# Altium project SIC462.PrjPcb
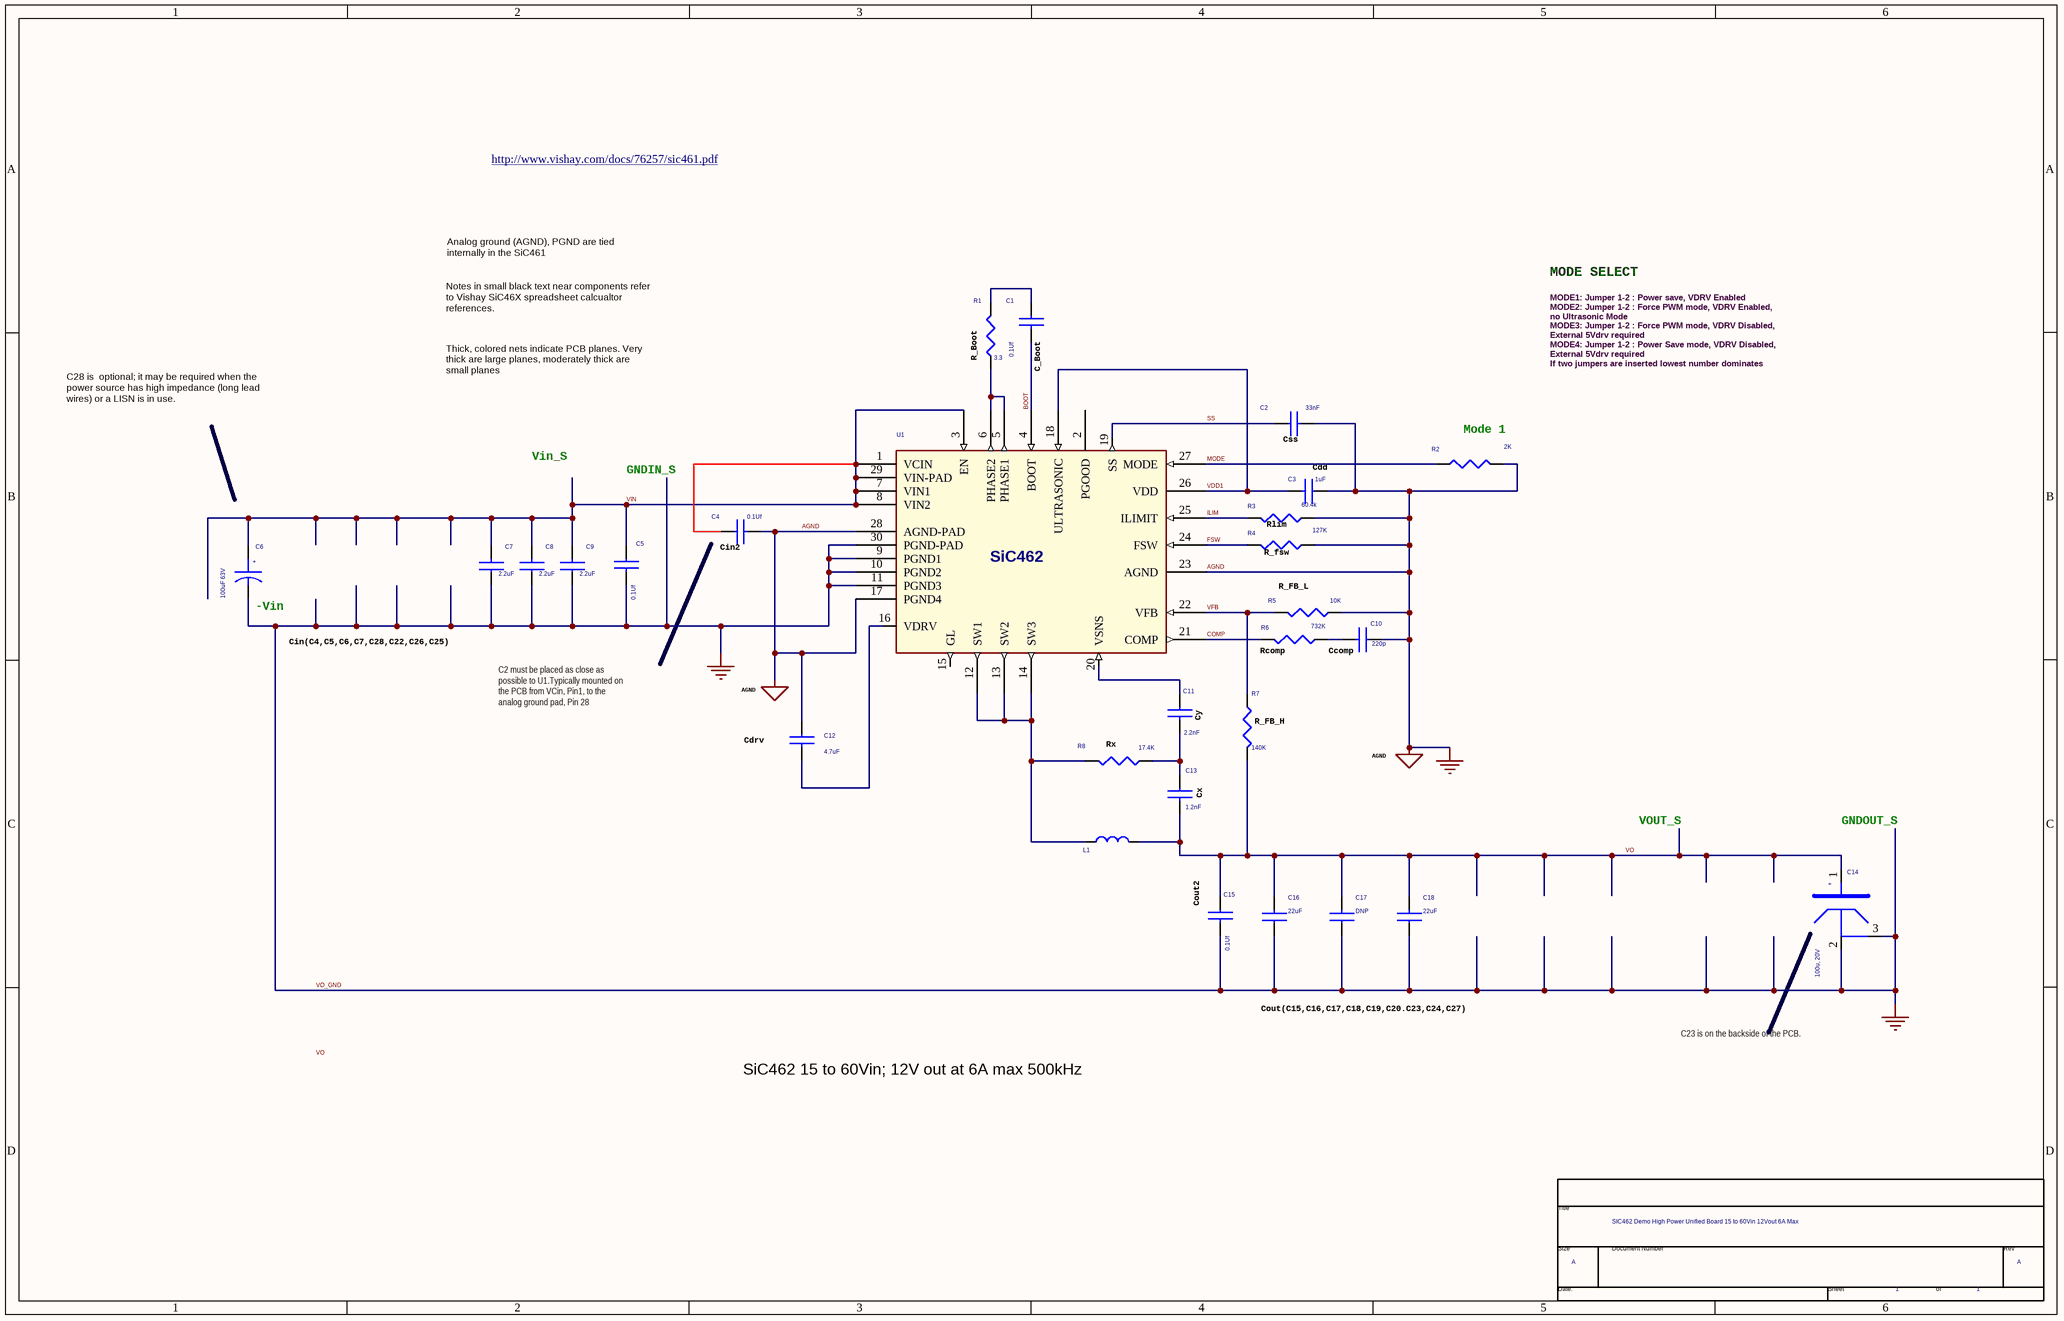
[diagram p0: SiC462 12V 6A.SchDoc]
1 sheet, 29 parts. Net scope: global (net labels, ports and power ports of the same name join across sheets).
Board file: PCB1.PcbDoc

## Sheet SiC462 12V 6A.SchDoc
size 386 x 246 mm

### Parts
*  RevCode: A  Title: SIC462 Demo High Power Unified Board 15 to 60Vin 12Vout 6A Max  Page Number: 1  (hidden comment: TitleBlock0)  (graphical)
C1  0.1Uf  [RR_0603]
C2  33nF  [RR_0603]
C3  1uF  [RR_0603]
C4  0.1Uf  [RR_0603]
C5  0.1Uf  [RR_0603]
C6  100uF 63V  [RR_CAP-RAD-D10x9]
C7  2.2uF  [RR_1210]
C8  2.2uF  [RR_1210]
C9  2.2uF  [RR_1210]
C10  220p  [RR_0603]
C11  2.2nF  [RR_0603]
C12  4.7uF  [RR_1206]
C13  1.2nF  [RR_0603]
C14  100u, 20V  [RR_CAP-RAD-D10x9]
C15  0.1Uf  [RR_0805]
C16  22uF  [RR_1206]
C17  DNP  [RR_1206]
C18  22uF  [RR_1206]
L1  (no value)  [RR_IND_CMD_12x12]
R1  3.3  [RR_0603]
R2  2K  [RR_0603]
R3  60.4k  [RR_0603]
R4  127K  [RR_0603]
R5  10K  [RR_0603]
R6  732K  [RR_0603]
R7  140K  [RR_0603]
R8  17.4K  [RR_0603]
U1  SiC462  [SIC462]

### Nets
AGND: C2.2 C3.1 C4.2 C5.2 C6.2 C7.1 C8.1 C9.1 C10.1 C12.1 C14.2 C14.3 C15.2 C16.1 C17.1 C18.1 R2.2 R3.1 R4.1 R5.1 U1.9(PGND1) U1.10(PGND2) U1.11(PGND3) U1.17(PGND4) U1.23(AGND) U1.28(AGND-PAD) U1.30(PGND-PAD)  [also labelled GND, GND_SIGNAL, VO_GND]
BOOT: C1.2 U1.4(BOOT)
COMP: R6.2 U1.21(COMP)
FSW: R4.2 U1.24(FSW)
ILIM: R3.2 U1.25(ILIMIT)
MODE: R2.1 U1.27(MODE)
SS: C2.1 U1.19(SS)
VDD1: C3.2 U1.18(ULTRASONIC) U1.26(VDD)
VFB: R5.2 R7.1 U1.22(VFB)
VIN: C4.1 C5.1 C6.1 C7.2 C8.2 C9.2 U1.1(VCIN) U1.3(EN) U1.7(VIN1) U1.8(VIN2) U1.29(VIN-PAD)
VO: C13.2 C14.1 C15.1 C16.2 C17.2 C18.2 L1.1(A) R7.2
NetC1_1: C1.1 R1.2
NetC10_2: C10.2 R6.1
NetC11_1: C11.1 U1.20(VSNS)
NetC11_2: C11.2 C13.1 R8.1
NetC12_2: C12.2 U1.16(VDRV)
NetL1_2: L1.2(B) R8.2 U1.12(SW1) U1.13(SW2) U1.14(SW3)
NetR1_1: R1.1 U1.5(PHASE1) U1.6(PHASE2)

Not connected (* = marked no-connect by the designer): U1 2(PGOOD) 15(GL)

### Notes on the sheet
- http://www.vishay.com/docs/76257/sic461.pdf
- Notes in small black text near components refer
  to Vishay SiC46X spreadsheet calcualtor
  references.
- Analog ground (AGND), PGND are tied
  internally in the SiC461
- MODE SELECT
- Thick, colored nets indicate PCB planes. Very
  thick are large planes, moderately thick are
  small planes
- (near R1) R_Boot
- (near C1) C_Boot
- C28 is  optional; it may be required when the
  power source has high impedance (long lead
  wires) or a LISN is in use.
- Vin_S
- (near C2) Css
- (near R2) Mode 1
- MODE1: Jumper 1-2 : Power save, VDRV Enabled
  MODE2: Jumper 1-2 : Force PWM mode, VDRV Enabled,
  no Ultrasonic Mode
  MODE3: Jumper 1-2 : Force PWM mode, VDRV Disabled,
  External 5Vdrv required
  MODE4: Jumper 1-2 : Power Save mode, VDRV Disabled,
  External 5Vdrv required
  If two jumpers are inserted lowest number dominates
- GNDIN_S
- (near R3) Rlim
- (near C3) Cdd
- (near C4) Cin2
- (near R4) R_fsw
- (near R5) R_FB_L
- (near C6) -Vin
- Cin(C4,C5,C6,C7,C28,C22,C26,C25)
- (near R6) Rcomp
- Ccomp
- C2 must be placed as close as
  possible to U1.Typically mounted on
  the PCB from VCin, Pin1, to the
  analog ground pad, Pin 28
- AGND
- (near C11) Cy
- (near R7) R_FB_H
- (near C12) Cdrv
- (near R8) Rx
- (near C13) Cx
- VOUT_S
- GNDOUT_S
- (near C15) Cout2
- Cout(C15,C16,C17,C18,C19,C20.C23,C24,C27)
- C23 is on the backside of the PCB.
- SiC462 15 to 60Vin; 12V out at 6A max 500kHz
- Labels drawn without touching a wire or pin: VO
- (in symbol CAP POL) +
- (in symbol CAP, TA-P,V,470u, 2V_0) +
- (in symbol TitleBlock0) Title; Size; Document Number; Rev; Date:; Sheet; of

### Library data of the parts
C1 C4 = CAP NP: Ceramic Cap, 0.1uF,100volts, X7S, 10%, 0603; Mfr: Murata Electronics; Mfr Part Number: C1608X7S2A104K080AB; Package2: 0603; Tolerance: 10%; DIGI-KEY: 810-C1608X7S2A104K; Package: 0603; Package1: 0603; PCB Footprint2: 0603; Description2: Ceramic Cap, 0.1uF,100volts, X7S, 10%, 0603; Value2: 0.1uF; Value1: 0.1uF; Description1: Ceramic Cap, 0.1uF,100volts, X7S, 10%, 0603; PCB Footprint1: 0603; Data sheet\: http://www.mouser.com/ds/2/400/lcc_commercial_general_en-837201.pdf; DigikeyMouser: 810-C1608X7S2A104K
C2 = CAP NP: Ceramic Cap, 0.033uF,50V,X7R,0603,10%; Mfr Part Number: VJ0603Y333KXACW1BC; Mfr: Vishay / Vitramon; Manufacturer: Vishay; Package1: 0603; Voltage: 50V; Tolerance: 10%; Data sheet\: http://www.mouser.com/ds/2/427/vjw1bcbascomseries-223529.pdf; DigikeyMouser: 77-VJ0603Y333KXACBC; Value2: 33nF; Value1: 33nF; Description1: Ceramic Cap, 0.033uF,50V,X7R,0603,10%; Description2: Ceramic Cap, 0.033uF,50V,X7R,0603,10%; Package: 0603; Package2: 0603; Manufacturer Part: VJ0603Y333KXACW1BC; Manufacturer Part1: VJ0603Y333KXACW1BC; Manufacturer Part2: VJ0603Y333KXACW1BC; Manufacturer1: Vishay; Manufacturer2: Vishay; DIGI-KEY: 77-VJ0603Y333KXACBC
C3 = CAP NP: Ceramic Cap, 1uF,50V, X7R,0603,10%; Manufacturer1: Taiyo Yuden; Manufacturer Part1: UMK107AB7105KA-T; Package2: 0603; Manufacturer2: Taiyo Yuden; Manufacturer Part2: UMK107AB7105KA-T; Manufacturer: Taiyo Yuden; Manufacturer Part: UMK107AB7105KA-T; Package: 0603; Package1: 0603; Description2: Ceramic Cap, 1uF,50V, X7R,0603,10%; Description1: Ceramic Cap, 1uF,50V, X7R,0603,10%; Value1: 1uF; Value2: 1uF; DigikeyMouser: 963-UMK107AB7105KA-T; Mfr: Taiyo Yuden; Data sheet\: http://www.mouser.com/ds/2/396/mlcc11_hq_e-541564.pdf; Tolerance: 10%; Voltage: 50V; Mfr Part Number: UMK107AB7105KA-T; DIGI-KEY: 963-UMK107AB7105KA-T
C5 C15 = CAP NP: Ceramic Cap, 0.1uF,100volts, X7S, 10%, 0603; Mfr Part Number: C1608X7S2A104K080AB; Mfr: Murata Electronics; PCB Footprint1: 0603; DigikeyMouser: 810-C1608X7S2A104K; Data sheet\: http://www.mouser.com/ds/2/400/lcc_commercial_general_en-837201.pdf; Description1: Ceramic Cap, 0.1uF,100volts, X7S, 10%, 0603; Value1: 0.1uF; Value2: 0.1uF; Description2: Ceramic Cap, 0.1uF,100volts, X7S, 10%, 0603; PCB Footprint2: 0603; Package1: 0603; Package: 0603; Package2: 0603; DIGI-KEY: 810-C1608X7S2A104K; Tolerance: 10%
C6 = CAP POL: CAP, alum, 100uF, 63volt, 105C, 10x12, 4khr; Mfr Part Number: MAL215058101E3; Mfr: Vishay; Tolerance: 20%; DigikeyMouser: 594-2222-150-58101; Data sheet\: http://www.mouser.com/ds/2/427/150rmi-222630.pdf; DIGI-KEY: 594-2222-150-58101; Rating: 63V; Part Type: CAP POL; Manufacturer: Vishay
C7 C9 = CAP NP: Ceramic Cap, 2.2uF,100volts, X7R, 10%, 1210; Mfr Part Number: GRM32ER72A225KA35K; Mfr: Murata Electronics; DigikeyMouser: 81-GRM32ER72A225KA5K; Data sheet\: http://www.mouser.com/ds/2/281/c02e-2905.pdf; Description2: Ceramic Cap, 2.2uF,100volts, X7R, 10%, 1210; Value2: 2.2uF; Value1: 2.2uF; Description1: Ceramic Cap, 2.2uF,100volts, X7R, 10%, 1210; DIGI-KEY: 81-GRM32ER72A225KA5K
C8 = CAP NP: Ceramic Cap, 2.2uF,100volts, X7R, 10%, 1210; Mfr: Murata Electronics; Mfr Part Number: GRM32ER72A225KA35K; DIGI-KEY: 81-GRM32ER72A225KA5K; Description1: Ceramic Cap, 2.2uF,100volts, X7R, 10%, 1210; Value1: 2.2uF; Value2: 2.2uF; Description2: Ceramic Cap, 2.2uF,100volts, X7R, 10%, 1210; Data sheet\: http://www.mouser.com/ds/2/281/c02e-2905.pdf; DigikeyMouser: 81-GRM32ER72A225KA5K
C10 = CAP NP: Ceramic Cap, 220p,100V,COG,0603, 5%; Manufacturer1: Vishay; Manufacturer Part1: VJ0603A221JXBPW1BC; Package2: 0603; DIGI-KEY: 77-VJ0603A221JXBPBC; Manufacturer2: Vishay; Manufacturer Part2: VJ0603A221JXBPW1BC; Manufacturer: Vishay; Manufacturer Part: VJ0603A221JXBPW1BC; Package: 0603; Package1: 0603; Description2: Ceramic Cap, 220p,100V,COG,0603, 5%; Description1: Ceramic Cap, 220p,100V,COG,0603, 5%; Value1: 220p; Value2: 220p; Mfr Part Number: VJ0603A221JXBPW1BC; Voltage: 100V; Tolerance: 5%; Data sheet\: http://www.mouser.com/ds/2/427/vjw1bcbascomseries-223529.pdf; Mfr: Vishay; DigikeyMouser: 77-VJ0603A221JXBPBC
C11 = CAP NP: Ceramic Cap, 2200pF,100V,X7R,0603, 5%; Mfr: Vishay; Mfr Part Number: VJ0603Y222JXBCW1BC; Package1: 0603; DIGI-KEY: 77-VJ0603Y222JXBCBC; DigikeyMouser: 77-VJ0603Y222JXBCBC; Data sheet\: http://www.mouser.com/ds/2/427/vjw1bcbascomseries-223529.pdf; Tolerance: 5%; Voltage: 100V; Value2: 2.2nF; Value1: 2.2nF; Description1: Ceramic Cap, 2200pF,100V,X7R,0603, 5%; Description2: Ceramic Cap, 2200pF,100V,X7R,0603, 5%; Package: 0603; Package2: 0603; Manufacturer Part: VJ0603Y222JXBCW1BC; Manufacturer Part1: VJ0603Y222JXBCW1BC; Manufacturer: Vishay; Manufacturer Part2: VJ0603Y222JXBCW1BC; Manufacturer1: Vishay; Manufacturer2: Vishay
C12 = CAP NP: Ceramic Cap, 4.7uF,25V,X6S,10%,0603; Mfr: Murata; Mfr Part Number: GRM188C81E475KE11D; DigikeyMouser: 81-GRM188C81E475KE1D; Data sheet\: http://www.mouser.com/ds/2/281/c02e-2905.pdf; Tolerance: 10%; Voltage: 25V; Value2: 4.7uF; Value1: 4.7uF; Description1: Ceramic Cap, 4.7uF,25V,X6S,10%,0603; Description2: Ceramic Cap, 4.7uF,25V,X6S,10%,0603; DIGI-KEY: 81-GRM188C81E475KE1D
C13 = CAP NP: Ceramic Cap, 1.2nF,100V,X7R,0805, 10%; Manufacturer1: Vishay; Manufacturer Part1: VJ0805Y122KXBPW1BC; Mfr: Vishay / Vitramon; Package2: 0805; DIGI-KEY: 77-VJ0805Y122KXBPBC; Manufacturer2: Vishay; Manufacturer Part2: VJ0805Y122KXBPW1BC; Manufacturer: Vishay; Manufacturer Part: VJ0805Y122KXBPW1BC; Package: 0805; Package1: 0805; Description2: Ceramic Cap, 1.2nF,100V,X7R,0805, 10%; Description1: Ceramic Cap, 1.2nF,100V,X7R,0805, 10%; Value1: 1.2nF; Value2: 1.2nF; DigikeyMouser: 77-VJ0805Y122KXBPBC; Data sheet\: http://www.mouser.com/ds/2/427/vjw1bcbascomseries-223529.pdf; Tolerance: 10%; Voltage: 100V; Mfr Part Number: VJ0805Y122KXBPW1BC
C14 = CAP, TA-P,V,470u, 2V_0: Polymer SMD 20volts 100uF ESR 55mohm 7343; Mfr Part Number: 20TQC100MYF; Mfr: Panasonic; Data sheet\: http://www.mouser.com/ds/2/315/AAA8000C54-931458.pdf; DigikeyMouser: 667-20TQC100MYF; DIGI-KEY: 667-20TQC100MYF
C16 C18 = CAP NP: Ceramic Cap, 22uF,25volts,X7R,10%,1206; Mfr: AVX Corporation; Mfr Part Number: 12061C225KAT2A; Voltage: 100V; DIGI-KEY: 581-12061C225KAT2A; Description2: Ceramic Cap, 22uF,25volts,X7R,10%,1206; Description1: Ceramic Cap, 22uF,25volts,X7R,10%,1206; Value1: 22uF; Value2: 22uF; DigikeyMouser: 581-12061C225KAT2A; Tolerance: 10%; Data sheet\: http://www.mouser.com/ds/2/40/X7RDielectric-777024.pdf
C17 = CAP NP: Ceramic Cap, 22uF,25volts,X7R,10%,1206; Mfr Part Number: 12061C225KAT2A; Mfr: AVX Corporation; Voltage: 100V; Data sheet\: http://www.mouser.com/ds/2/40/X7RDielectric-777024.pdf; Tolerance: 10%; DigikeyMouser: 581-12061C225KAT2A; Value2: 22uF; Value1: 22uF; Description1: Ceramic Cap, 22uF,25volts,X7R,10%,1206; Description2: Ceramic Cap, 22uF,25volts,X7R,10%,1206; DIGI-KEY: 581-12061C225KAT2A
L1 = IND: INDUCTOR, 3.3uH,20%,14m DCR,18.6A Saturation; Mfr Part Number: IHLP4040DZER100M01; Manufacturer: Vishay; Mfr: Vishay Dale; Manufacturer Part: IHLP4040DZER3R3M11; Manufacturer Part1: IHLP4040DZER5R6M01; Current: 8A; PSpice Template: L^@REFDES %A %B @ MODEL @VALUE; Value2: 10uH; Value1: 5.6uH; Description1: INDUCTOR, 5.6uH,20%,19m DCR,16A Saturation; Description2: INDUCTOR, 10uH,20%,17.2m DCR,15.5A Saturation; Package1: 4040; Package2: 5050; Data sheet\: http://www.vishay.com/docs/34193/lp40dz01.pdf; DigikeyMouser: 541-1295-1-ND; Manufacturer Part2: IHLP5050FDER100M01; Manufacturer1: Vishay; Manufacturer2: Vishay
R1 = RESISTOR: SMD,3.3Ohm, 1% 0603; Man Part Number2: CRCW06033R30FKEA; Manufacturer Part: CRCW06030000ZSTA; PCB Footprint1: 0603; Man1: Vishay; DigikeyMouser: 71-CRCW06033R30FKEA; Data sheet\: http://www.mouser.com/ds/2/427/dcrcwe3-109170.pdf; Value1: 3.3; Description2: SMD,3.3Ohm, 1% 0603; Man: Vishay; Man Part Number: CRCW06033R30FKEA; Description1: SMD,3.3Ohm, 1% 0603; Man2: Vishay; Man Part Number1: CRCW06033R30FKEA; PCB Footprint2: 0603; Value2: 3.3; Package1: 0603; Package: 0603; Package2: 0603; Manufacturer Part1: CRCW06030000ZSTA; Manufacturer: Vishay; Manufacturer Part2: CRCW06030000ZSTA; Manufacturer1: Vishay; Manufacturer2: Vishay; DIGI-KEY: 71-CRCW06033R30FKEA; Mfr: Vishay; Mfr Part Number: CRCW06033R30FKEA
R2 = RESISTOR: SMD,2K,1%,0603; Manufacturer1: Vishay; Manufacturer Part1: CRCW06032K00FKEB; Mfr: Vishay Dale; Package2: 0603; DIGI-KEY: 71-CRCW06032K00FKEB; Manufacturer2: Vishay; Manufacturer Part2: CRCW06032K00FKEB; Manufacturer: Vishay; Manufacturer Part: CRCW06032K00FKEB; Package: 0603; Package1: 0603; Description2: SMD,2K,1%,0603; Description1: SMD,2K,1%,0603; Value1: 2K; Value2: 2K; DigikeyMouser: 71-CRCW06032K00FKEB; Data sheet\: http://www.mouser.com/ds/2/427/dcrcwe3-109170.pdf; Tolerance: 1%; Mfr Part Number: CRCW06032K00FKEB
R3 = RESISTOR: SMD,60.4K,1%,0603; Manufacturer1: Vishay; Manufacturer Part1: CRCW060360K4FKEA; Mfr: Vishay Dale; Package2: 0603; Manufacturer2: Vishay; Manufacturer Part2: CRCW060360K4FKEA; Manufacturer: Vishay; Manufacturer Part: CRCW060360K4FKEA; Package: 0603; Package1: 0603; Description2: SMD,60.4K,1%,0603; Description1: SMD,60.4K,1%,0603; Value1: 60.4K; Value2: 60.4K; DigikeyMouser: 71-CRCW0603-60.4K-E3; Data sheet\: http://www.digikey.com/product-detail/en/vishay-dale/CRCW04024K64FKED/541-4.64KLCT-ND/1183198; Tolerance: 1%; Mfr Part Number: CRCW060360K4FKEA; DIGI-KEY: 71-CRCW0603-60.4K-E3
R4 = RESISTOR: SMD,127K,1%,0603 100PPM; Manufacturer1: Vishay; Manufacturer Part1: CRCW0603127KFKEA; Mfr: Vishay Dale; Package2: 0603; Manufacturer2: Vishay; Manufacturer Part2: CRCW0603127KFKEA; Manufacturer: Vishay; Manufacturer Part: CRCW0603127KFKEA; Package: 0603; Package1: 0603; Description2: SMD,127K,1%,0603 100PPM; Description1: SMD,127K,1%,0603 100PPM; Value1: 127K; Value2: 127K; DigikeyMouser: 71-CRCW0603-127K-E3; Data sheet\: http://www.mouser.com/ds/2/427/dcrcwe3-109170.pdf; Tolerance: 1%; Mfr Part Number: CRCW0603127KFKEA; DIGI-KEY: 71-CRCW0603-127K-E3
R5 = RESISTOR: SMD,10K,1%,0603; Manufacturer1: Vishay; Manufacturer Part1: CRCW060310K0FKTA; Mfr: Vishay Dale; Package2: 0603; Manufacturer2: Vishay; Manufacturer Part2: CRCW060310K0FKTA; Manufacturer: Vishay; Manufacturer Part: CRCW060310K0FKTA; Package: 0603; Package1: 0603; Description2: SMD,10K,1%,0603; Description1: SMD,10K,1%,0603; Value1: 10K; Value2: 10K; DigikeyMouser: 71-CRCW0603-10K; Data sheet\: http://www.mouser.com/ds/2/427/dcrcwe3-109170.pdf; Tolerance: 1%; Mfr Part Number: CRCW060310K0FKTA; DIGI-KEY: 71-CRCW0603-10K
R6 = RESISTOR: SMD 1/10watt 732 kOhms 1%,0603; Mfr: Vishay Dale; Mfr Part Number: CRCW0603732KFKEA; Manufacturer: Vishay; Package1: 0603; DIGI-KEY: 71-CRCW0603-732K-E3; DigikeyMouser: 71-CRCW0603-732K-E3; Data sheet\: http://www.mouser.com/ds/2/427/dcrcwe3-109170.pdf; Tolerance: 1%; Value2: 732K; Value1: 732K; Description1: SMD 1/10watt 732 kOhms 1%,0603; Description2: SMD 1/10watt 732 kOhms 1%,0603; Package: 0603; Package2: 0603; Manufacturer Part: CRCW0603732KFKEA; Manufacturer Part1: CRCW0603732KFKEA; Manufacturer Part2: CRCW0603732KFKEA; Manufacturer1: Vishay; Manufacturer2: Vishay
R7 = RESISTOR: SMD 1,10W 140K Ohms 1% 0603; Manufacturer1: Vishay; Manufacturer Part1: CRCW0603140KFKEA; Mfr: Vishay Dale; Package2: 0603; Manufacturer2: Vishay; Manufacturer Part2: CRCW0603140KFKEA; Manufacturer: Vishay; Manufacturer Part: CRCW0603140KFKEA; Package: 0603; Package1: 0603; Description2: SMD 1,10W 140K Ohms 1% 0603; Description1: SMD 1,10W 140K Ohms 1% 0603; Value1: 140K; Value2: 140K; Mfr Part Number: CRCW0603140KFKEA; Tolerance: 1%; Data sheet\: http://www.mouser.com/ds/2/427/dcrcwe3-109170.pdf; DigikeyMouser: 71-CRCW0603-140K-E3; DIGI-KEY: 71-CRCW0603-140K-E3
R8 = RESISTOR: Resistors - SMD 1/8watt 17.4Kohms 1% 0805; Mfr: Vishay Dale; Mfr Part Number: CRCW080517K4FKTA; DIGI-KEY: 71-CRCW0805-17.4K; Description2: Resistors - SMD 1/8watt 17.4Kohms 1% 0805; Description1: Resistors - SMD 1/8watt 17.4Kohms 1% 0805; DigikeyMouser: 71-CRCW0805-17.4K; Data sheet\: http://www.mouser.com/ds/2/427/dcrcw-72725.pdf; Tolerance: 1%
U1 = SiC462CD-T1-GE3_27: 4.5~60V,6A, High Voltage microBuck; Mfr: Vishay; Man Part Number2: SiC462ED-T1-GE3; PCB Footprint1: 5mmx5mm; DIGI-KEY: 78-SIC462ED-T1-GE3; Value2: SiC462; Value1: SiC462; Man Part Number: SiC462ED-T1-GE3; Man1: Vishay; Description2: 4.5~60V,6A, High Voltage microBuck; Description1: 4.5~60V,6A, High Voltage microBuck; Man: Vishay; Man2: Vishay; Man Part Number1: SiC462ED-T1-GE3; PCB Footprint2: 5mmx5mm; Data sheet\: http://www.mouser.com/ds/2/427/sic462-1061838.pdf; DigikeyMouser: 78-SIC462ED-T1-GE3; Mfr Part Number: SiC462ED-T1-GE3
* = TitleBlock0: Page Create Date: March  8, 1995; Page Size: A; Page Count: 1